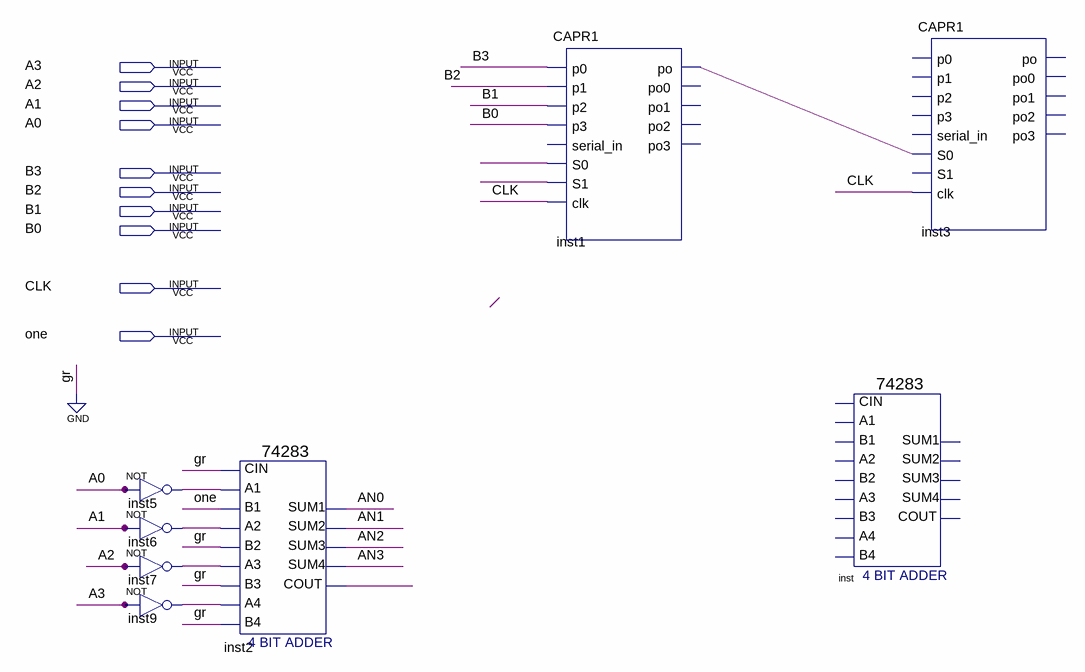
[diagram p0: schematic sheet]
// Quartus schematic Block2.bdf as structural Verilog: 8 symbols, 10 pins
module Block2 (
  input  A3,
  input  A2,
  input  A1,
  input  A0,
  input  B3,
  input  B2,
  input  B1,
  input  B0,
  input  CLK,
  input  one
);

  wire AN0, AN1, AN2, AN3, inst1_po, inst2_cout, inst5_out, inst6_out, inst7_out, inst9_out, undriven,
       undriven_2;

  not inst5 (inst5_out, A0);
  not inst6 (inst6_out, A1);
  not inst7 (inst7_out, A2);
  not inst9 (inst9_out, A3);
  \74283  inst2 (
    .CIN(1'b0), .A1(inst5_out), .A2(inst6_out), .B2(1'b0), .A3(inst7_out), .A4(inst9_out), .B4(1'b0),
    .B1(one), .B3(1'b0), .SUM4(AN3), .COUT(inst2_cout), .SUM1(AN0), .SUM2(AN1), .SUM3(AN2));
  CAPR1 inst1 (
    .p0(B3), .p1(B2), .p2(B1), .p3(B0), .S0(undriven), .S1(undriven_2), .clk(CLK), .po(inst1_po));  // open: serial_in, po0, po1, po2, po3
  \74283  inst ();  // open: CIN, A1, A2, B2, A3, A4, B4, B1, B3, SUM4, COUT, SUM1, SUM2, SUM3
  CAPR1 inst3 (.S0(inst1_po), .clk(CLK));  // open: p0, p1, p2, p3, serial_in, S1, po, po0, po1, po2, po3
endmodule
